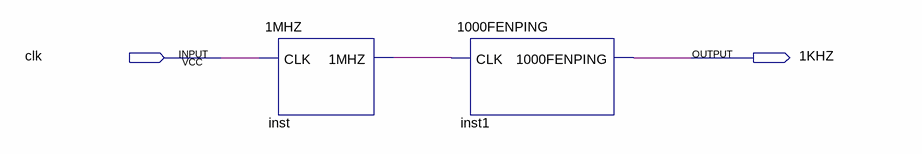
[diagram p0: schematic sheet]
// Quartus schematic 1KHZ.bdf as structural Verilog: 2 symbols, 2 pins
module \1KHZ  (
  input  clk,
  output \1KHZ 
);

  wire inst_1mhz;

  \1MHZ  inst (.CLK(clk), .\1MHZ (inst_1mhz));
  \1000FENPING  inst1 (.CLK(inst_1mhz), .\1000FENPING (\1KHZ ));
endmodule
